# EAGLE design Board 1 (EAGLE 9.3.1)
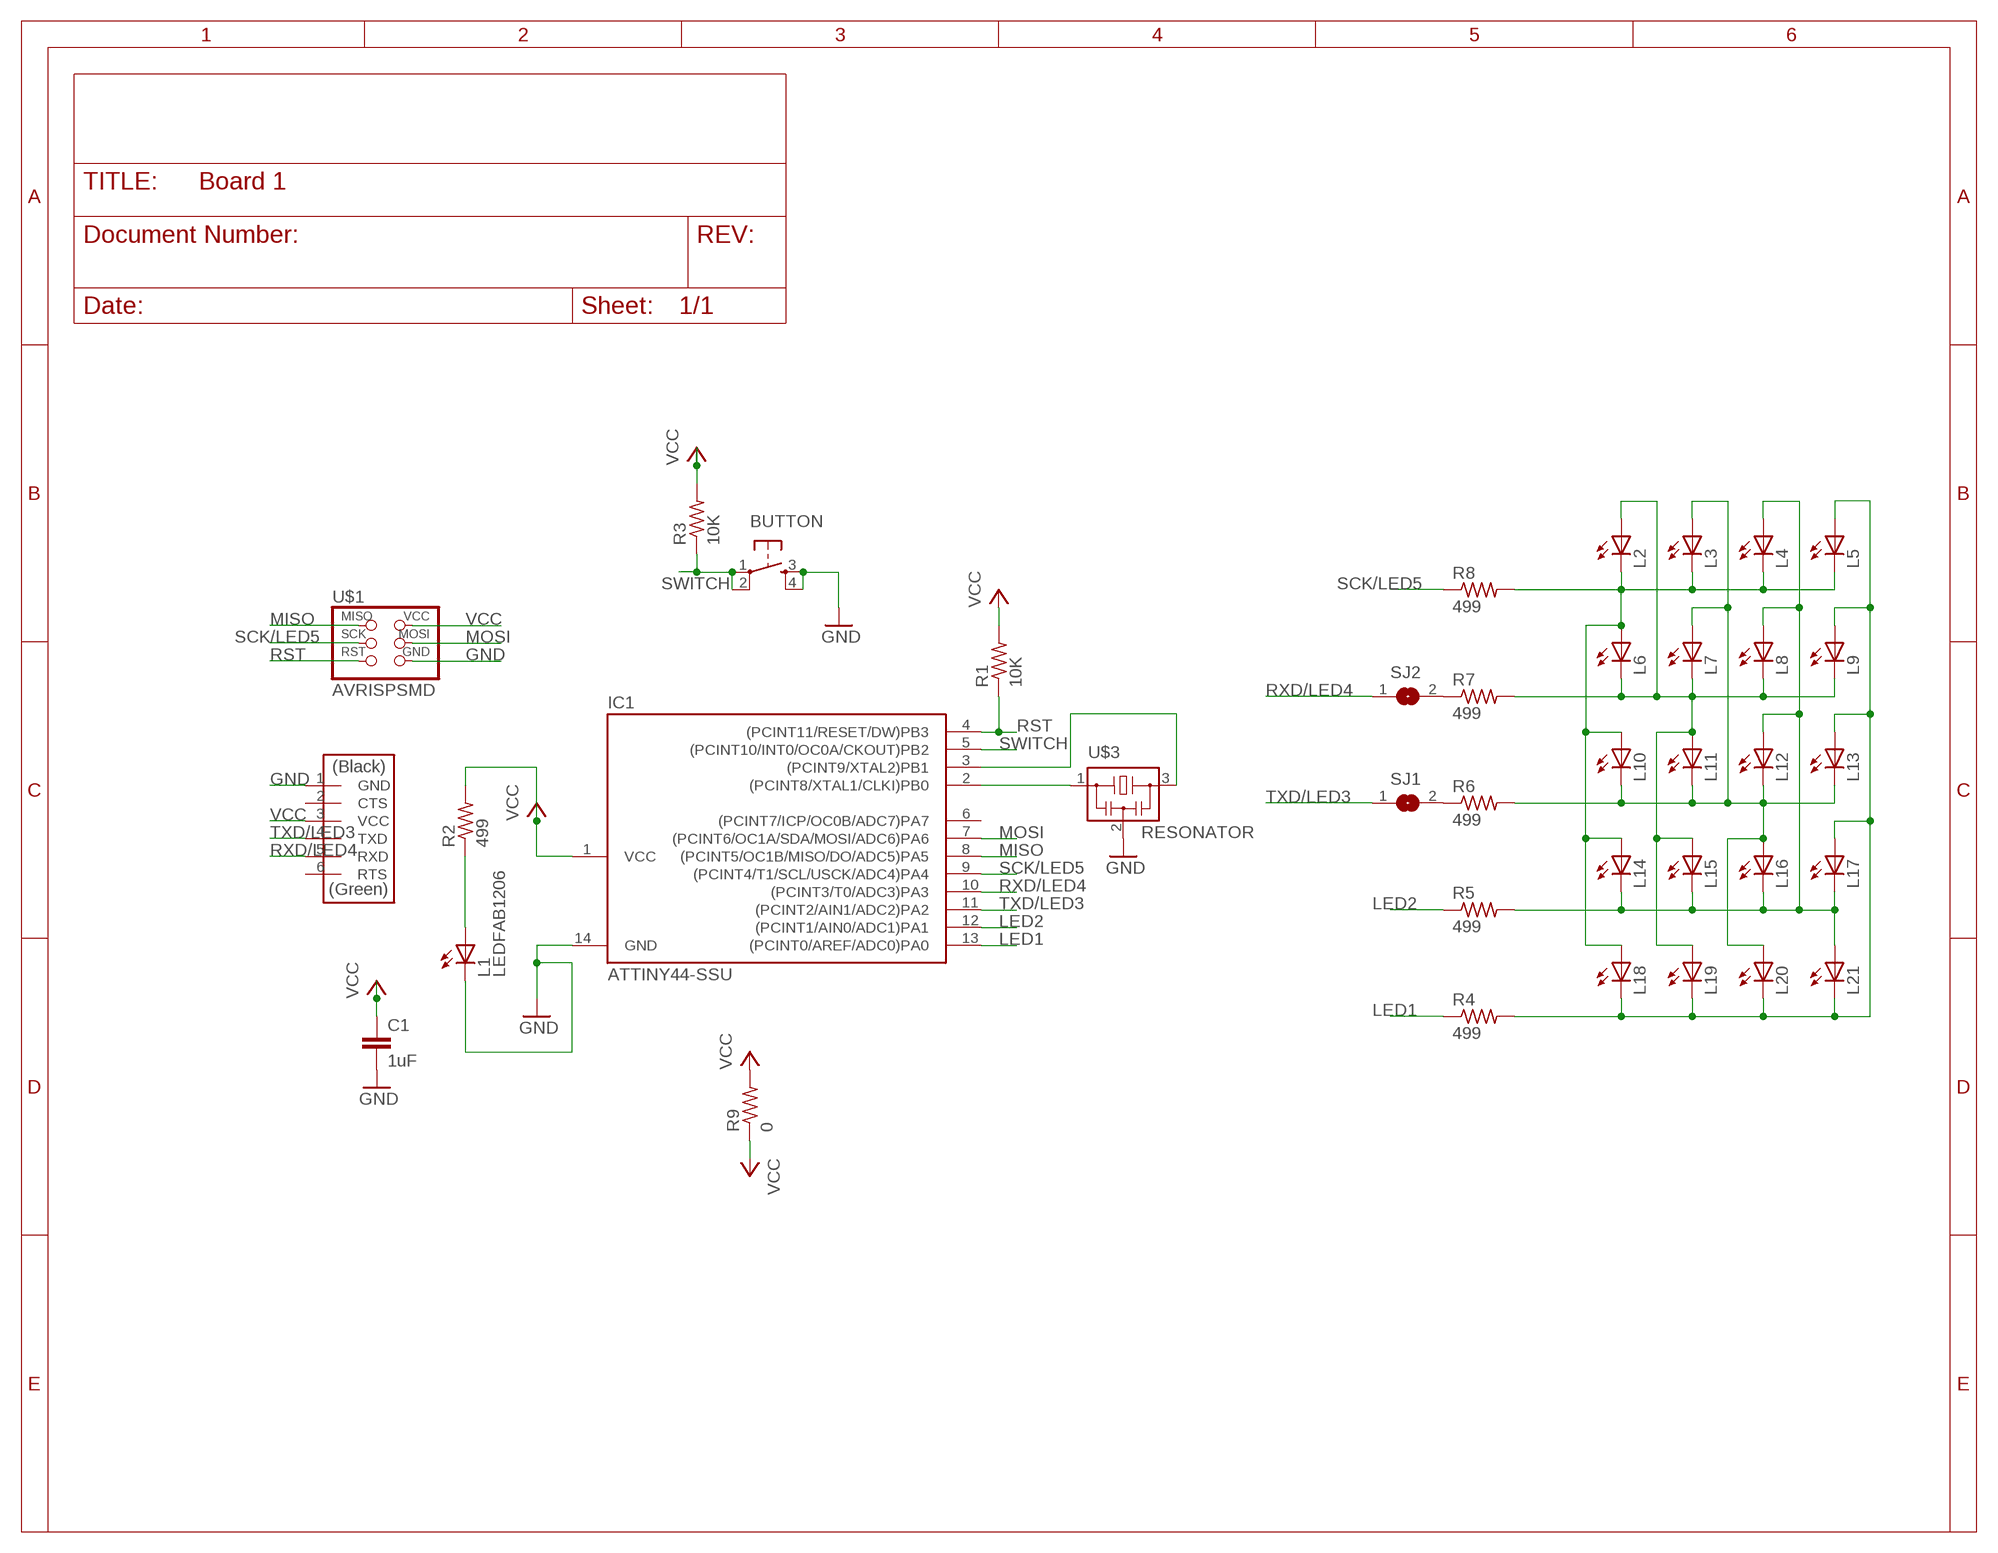
[diagram p0: schematic, sheet 1]

## Parts
BUTTON  6MM_SWITCH6MM_SWITCH  [6MM_SWITCH]
C1  1uF  C-EUC1206  [C1206]
FTDIHEADER  FTDI-SMD-HEADER  [1X06SMD]
IC1  ATTINY44-SSU  [SOIC14]
L1  LEDFAB1206  [LED1206FAB]
L2  LED  [LED1206]
L3  LED  [LED1206]
L4  LED  [LED1206]
L5  LED  [LED1206]
L6  LED  [LED1206]
L7  LED  [LED1206]
L8  LED  [LED1206]
L9  LED  [LED1206]
L10  LED  [LED1206]
L11  LED  [LED1206]
L12  LED  [LED1206]
L13  LED  [LED1206]
L14  LED  [LED1206]
L15  LED  [LED1206]
L16  LED  [LED1206]
L17  LED  [LED1206]
L18  LED  [LED1206]
L19  LED  [LED1206]
L20  LED  [LED1206]
L21  LED  [LED1206]
R1  10K  RES-US1206FAB  [R1206FAB]
R2  499  RES-US1206FAB  [R1206FAB]
R3  10K  RES-US1206FAB  [R1206FAB]
R4  499  RES-US1206FAB  [R1206FAB]
R5  499  RES-US1206FAB  [R1206FAB]
R6  499  RES-US1206FAB  [R1206FAB]
R7  499  RES-US1206FAB  [R1206FAB]
R8  499  RES-US1206FAB  [R1206FAB]
R9  0  RES-US1206FAB  [R1206FAB]
SJ1  SJ  [SJ]
SJ2  SJ  [SJ]
U$1  AVRISPSMD  [2X03SMD]
U$3  RESONATOR  [EFOBM]

## Nets
A: L2.2(C) L3.2(C) L4.2(C) L5.2(C) L6.1(A) L10.1(A) L14.1(A) L18.1(A) R8.2
B: L2.1(A) L6.2(C) L7.2(C) L8.2(C) L9.2(C) L11.1(A) L15.1(A) L19.1(A) R7.2
C: L3.1(A) L7.1(A) L10.2(C) L11.2(C) L12.2(C) L13.2(C) L16.1(A) L20.1(A) R6.2
D: L4.1(A) L8.1(A) L12.1(A) L14.2(C) L15.2(C) L16.2(C) L17.2(C) L21.1(A) R5.2
E: L5.1(A) L9.1(A) L13.1(A) L17.1(A) L18.2(C) L19.2(C) L20.2(C) L21.2(C) R4.2
GND: BUTTON.3(S) BUTTON.4(S1) C1.2 FTDIHEADER.1(GND) IC1.14(GND) L1.2(C) U$1.6(GND) U$3.2
LED1: IC1.13((PCINT0/AREF/ADC0)PA0) R4.1
LED2: IC1.12((PCINT1/AIN0/ADC1)PA1) R5.1
MISO: IC1.8((PCINT5/OC1B/MISO/DO/ADC5)PA5) U$1.1(MISO)
MOSI: IC1.7((PCINT6/OC1A/SDA/MOSI/ADC6)PA6) U$1.4(MOSI)
N$2: IC1.2((PCINT8/XTAL1/CLKI)PB0) U$3.1
N$4: IC1.3((PCINT9/XTAL2)PB1) U$3.3
N$5: L1.1(A) R2.1
RST: IC1.4((PCINT11/RESET/DW)PB3) R1.1 U$1.5(RST)
RXD/LED4: FTDIHEADER.5(RXD) IC1.10((PCINT3/T0/ADC3)PA3) R7.1 SJ2.1 SJ2.2
SCK/LED5: IC1.9((PCINT4/T1/SCL/USCK/ADC4)PA4) R8.1 U$1.3(SCK)
SWITCH: BUTTON.1(P) BUTTON.2(P1) IC1.5((PCINT10/INT0/OC0A/CKOUT)PB2) R3.1
TXD/LED3: FTDIHEADER.4(TXD) IC1.11((PCINT2/AIN1/ADC2)PA2) R6.1 SJ1.1 SJ1.2
VCC: C1.1 FTDIHEADER.3(VCC) IC1.1(VCC) R1.2 R2.2 R3.2 R9.1 R9.2 U$1.2(VCC)
Unconnected: FTDIHEADER.2(CTS) FTDIHEADER.6(RTS) IC1.6((PCINT7/ICP/OC0B/ADC7)PA7)

## Library data of the parts
BUTTON = fab:6MM_SWITCH: OMRON SWITCH
C1 = rcl:C-EU: CAPACITOR, European symbol
FTDIHEADER = fab:FTDI-SMD-HEADER
IC1 = fab:ATTINY44
L1 = fab:LED: LED
L2-L21 = 00fab:LED: LED
R1-R9 = 00fab:RES-US: Resistor (US Symbol) Variants with postfix FAB are widened to allow the routing of internal traces
SJ1 SJ2 = jumper:SJ: SMD solder JUMPER
U$1 = fab:AVRISP
U$3 = fab:RESONATOR

## Board
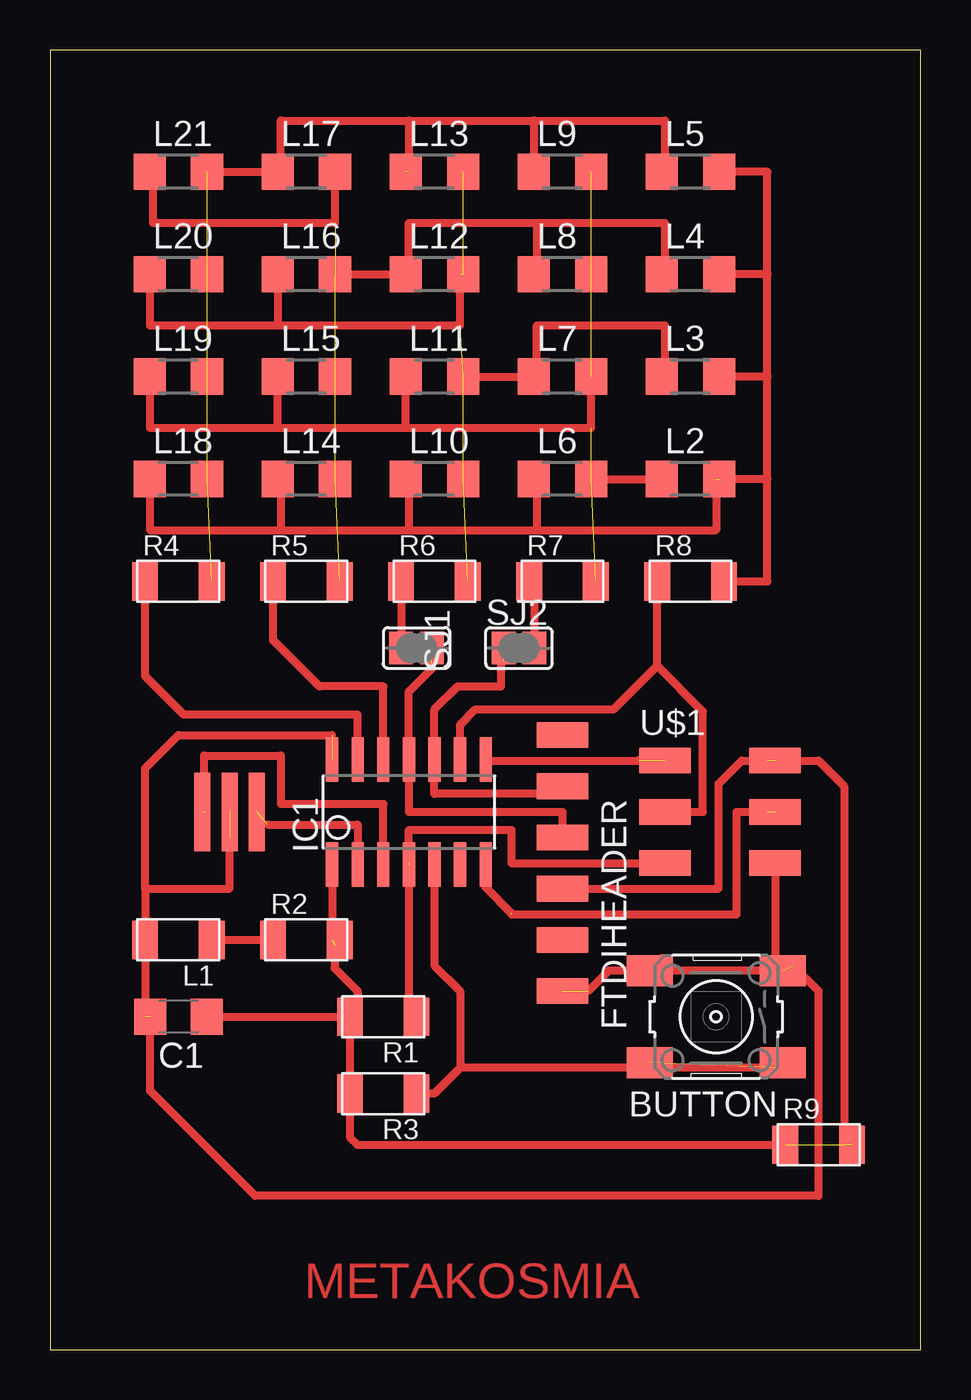
[diagram p1: board, top side]

Size 43.16 x 64.44 mm. Coordinates in mm from the lower left corner, seen from the top.
Outline: 0,0 43.16,0 43.16,64.44 0,64.44 0,0
Copper layers (1*16): Top 0.035mm / dielectric 0.15mm / Bottom 0.035mm
Design rules "default": minimum track width 6mil, minimum drill 0.35mm, track to track 6mil, track to pad 6mil, pad to pad 6mil, via to via 6mil, smd to smd 6mil, copper to edge 40mil, drill to drill 6mil, minimum pad ring 10mil, minimum via ring 8mil, stop-mask expansion 4mil, vias tented up to drill 0mil, thermal gap 10mil

### Footprints (pad centres in the part's own frame; a part is rotated, then mirrored left to right if it is on the bottom)
6MM_SWITCH = smd 2.286 x 1.524: 1 -3.302,2.286; 2 3.302,2.286; 3 -3.302,-2.286; 4 3.302,-2.286
C1206 = smd 1.6 x 1.8: 1 -1.4,0; 2 1.4,0
1X06SMD = smd 2.54 x 1.27: 1 0,6.35; 2 0,3.81; 3 0,1.27; 4 0,-1.27; 5 0,-3.81; 6 0,-6.35
SOIC14 = smd 0.61 x 2.21: 1 -3.81,-2.603; 2 -2.54,-2.603; 3 -1.27,-2.603; 4 0,-2.603; 5 1.27,-2.603; 6 2.54,-2.603; 7 3.81,-2.603; 8 3.81,2.603; 9 2.54,2.603; 10 1.27,2.603; 11 0,2.603; 12 -1.27,2.603; 13 -2.54,2.603; 14 -3.81,2.603
LED1206FAB = smd 1.27 x 1.905: 1 -1.651,0; 2 1.651,0
LED1206 = smd 1.6 x 1.803: 1 -1.422,0; 2 1.422,0
R1206FAB = smd 1.27 x 1.905: 1 -1.651,0; 2 1.651,0
SJ = smd 1.168 x 1.6: 1 -0.762,0; 2 0.762,0
2X03SMD = smd 2.54 x 1.27: 1 -2.54,2.54; 2 2.92,2.54; 3 -2.54,0; 4 2.92,0; 5 -2.54,-2.54; 6 2.92,-2.54
EFOBM = smd 0.8 x 3.9: 1 -1.35,0; 2 0,0; 3 1.35,0

### Placement (x,y rotation side)
BUTTON  33.02,16.51 180 top
C1  6.35,16.51 180 top
FTDIHEADER  25.4,24.13 180 top
IC1  17.78,26.67 0 top
L1  6.35,20.32 180 top
L2  31.75,43.18 0 top
L3  31.75,48.26 0 top
L4  31.75,53.34 0 top
L5  31.75,58.42 0 top
L6  25.4,43.18 0 top
L7  25.4,48.26 0 top
L8  25.4,53.34 0 top
L9  25.4,58.42 0 top
L10  19.05,43.18 0 top
L11  19.05,48.26 0 top
L12  19.05,53.34 0 top
L13  19.05,58.42 0 top
L14  12.7,43.18 0 top
L15  12.7,48.26 0 top
L16  12.7,53.34 0 top
L17  12.7,58.42 0 top
L18  6.35,43.18 0 top
L19  6.35,48.26 0 top
L20  6.35,53.34 0 top
L21  6.35,58.42 0 top
R1  16.51,16.51 180 top
R2  12.7,20.32 0 top
R3  16.51,12.7 180 top
R4  6.35,38.1 0 top
R5  12.7,38.1 0 top
R6  19.05,38.1 0 top
R7  25.4,38.1 0 top
R8  31.75,38.1 0 top
R9  38.1,10.16 0 top
SJ1  18.16,34.8 180 top
SJ2  23.24,34.8 0 top
U$1  33.02,26.67 0 top
U$3  8.89,26.67 180 top

### Tracks (layer width: path | path; a pad name or v marks a point on that pad's centre or on a via)
A  (1 unrouted)
  Top 0.305: L14.1 11.43,43.18 | L10.1 17.78,43.18 | L6.1 24.13,43.18
  Top 0.406: L18.1 4.93,40.64 11.43,40.64 | 11.43,40.64 17.78,40.64 | 17.78,40.64 24.13,40.64 | 24.13,40.64 33.02,40.64 33.02,43.18 35.56,43.18 | 11.43,43.18 11.43,40.64 | 17.78,43.18 17.78,40.64 | 24.13,43.18 24.13,40.64 | R8.2 35.56,38.1 35.56,43.18 | 35.56,43.18 35.56,48.26 | 35.56,48.26 35.56,53.34 | 35.56,53.34 35.56,58.42 L5.2 | 35.56,53.34 L4.2 | 35.56,48.26 L3.2
B  (4 unrouted)
  Top 0.305: 17.78,45.72 17.63,45.72
  Top 0.406: L19.1 4.93,45.72 11.28,45.72 | L7.2 26.82,45.72 17.78,45.72 | 11.28,45.72 17.63,45.72 L11.1 | 11.28,45.72 L15.1 | L6.2 L2.1
C  (5 unrouted)
  Top 0.152: 11.43,53.34 L16.1
  Top 0.305: L7.1 24.13,48.26 | 30.48,48.26 L3.1
  Top 0.406: L20.1 4.93,50.8 11.28,50.8 | 11.28,50.8 20.32,50.8 20.32,53.34 | L16.1 11.28,50.8 | 24.13,48.26 24.13,50.8 30.48,50.8 30.48,48.26 | L11.2 L7.1
D  (4 unrouted)
  Top 0.152: L12.1 17.78,53.34 | 30.48,53.34 L4.1 | 24.13,53.34 L8.1
  Top 0.305: L21.1 5.08,58.42
  Top 0.406: 17.78,53.34 17.78,55.88 24.13,55.88 | 24.13,55.88 30.48,55.88 30.48,53.34 | 24.13,55.88 24.13,53.34 | 5.08,58.42 5.08,55.88 14.12,55.88 L17.2 | L16.2 L12.1
E  (5 unrouted)
  Top 0.152: 30.48,58.42 L5.1
  Top 0.305: L17.1 11.43,58.42
  Top 0.406: 17.78,60.96 11.43,60.96 11.43,58.42 L21.2 | 17.78,60.96 23.98,60.96 | 23.98,60.96 30.48,60.96 30.48,58.42 | 23.98,60.96 L9.1 | 17.78,60.96 17.78,58.42
GND  (5 unrouted)
  Top 0.406: 4.7,22.86 L1.2 4.7,16.51 | 35.56,24.13 U$1.6 35.94,19.18 BUTTON.3 BUTTON.4 | 4.7,22.86 4.7,28.83 6.35,30.48 13.97,30.48 | 30.35,19.43 BUTTON.4 | 4.7,22.86 8.89,22.86 8.89,25.4 | 30.1,19.18 BUTTON.4 | BUTTON.4 27.69,18.8 26.67,17.78 | 36.83,19.05 38.1,17.78 38.1,7.62 10.16,7.62 4.95,12.83 C1.2
LED1
  Top 0.406: IC1.13 15.24,31.5 6.6,31.5 4.7,33.4 R4.1
LED2
  Top 0.406: IC1.12 16.51,32.89 13.33,32.89 11.05,35.18 R5.1
MISO  (1 unrouted)
  Top 0.406: 29.21,29.21 29.21,29.27 | IC1.8 21.65,29.21 U$1.1
MOSI  (2 unrouted)
  Top 0.406: 22.86,21.65 21.59,22.92 IC1.7 | 22.86,21.59 34.04,21.59 34.04,26.67 35.56,26.67
N$2  (1 unrouted)
  Top 0.406: 10.77,26.04 15.24,26.04 IC1.2
N$4  (1 unrouted)
  Top 0.406: IC1.3 16.51,27.05 11.43,27.05 11.43,29.46 7.62,29.46 7.62,26.67
N$5
  Top 0.406: L1.1 R2.1
RST  (1 unrouted)
  Top 0.406: IC1.4 17.78,25.78 22.86,25.78 22.86,24.13 U$1.5 | 17.78,24.13 17.78,16.89 R1.1
RXD/LED4  (2 unrouted)
  Top 0.406: FTDIHEADER.5 25.4,27.56 19.05,27.56 IC1.10 19.05,31.75 20.19,32.89 22.35,32.89 22.35,34.04 22.48,34.16 | R7.1 24,38.1 SJ2.2
SCK/LED5
  Top 0.406: 30.1,33.91 27.94,31.75 21.08,31.75 20.32,30.99 IC1.9 | 30.1,33.91 R8.1 | U$1.3 32.36,26.67 32.36,31.65 30.1,33.91
SWITCH  (1 unrouted)
  Top 0.406: 17.78,12.7 R3.1 19.05,12.7 20.32,13.97 | 36.58,13.97 BUTTON.1 36.07,13.97 20.32,13.97 | IC1.5 19.05,19.05 20.32,17.78 20.32,13.97
TXD/LED3  (2 unrouted)
  Top 0.406: FTDIHEADER.4 25.4,26.67 17.78,26.67 IC1.11 17.78,32.64 18.92,33.78 18.92,34.04 | R6.1 SJ1.2
VCC  (5 unrouted)
  Top 0.406: FTDIHEADER.3 33.15,22.86 33.15,28.07 34.29,29.21 35.56,29.21 | U$1.2 38.1,29.21 39.37,27.94 39.37,10.16 | R1.2 R3.2 14.86,10.54 15.24,10.16 36.83,10.16 | C1.1 R1.2 | IC1.1 13.97,20.32 | R2.2 14.1,20.07 14.1,18.92 15.24,17.78 15.24,16.89 R1.2

### Text on the board
Top: METAKOSMIA